# EAGLE design Pure_VCA_SMD_V2_2 (EAGLE 7.5.0)
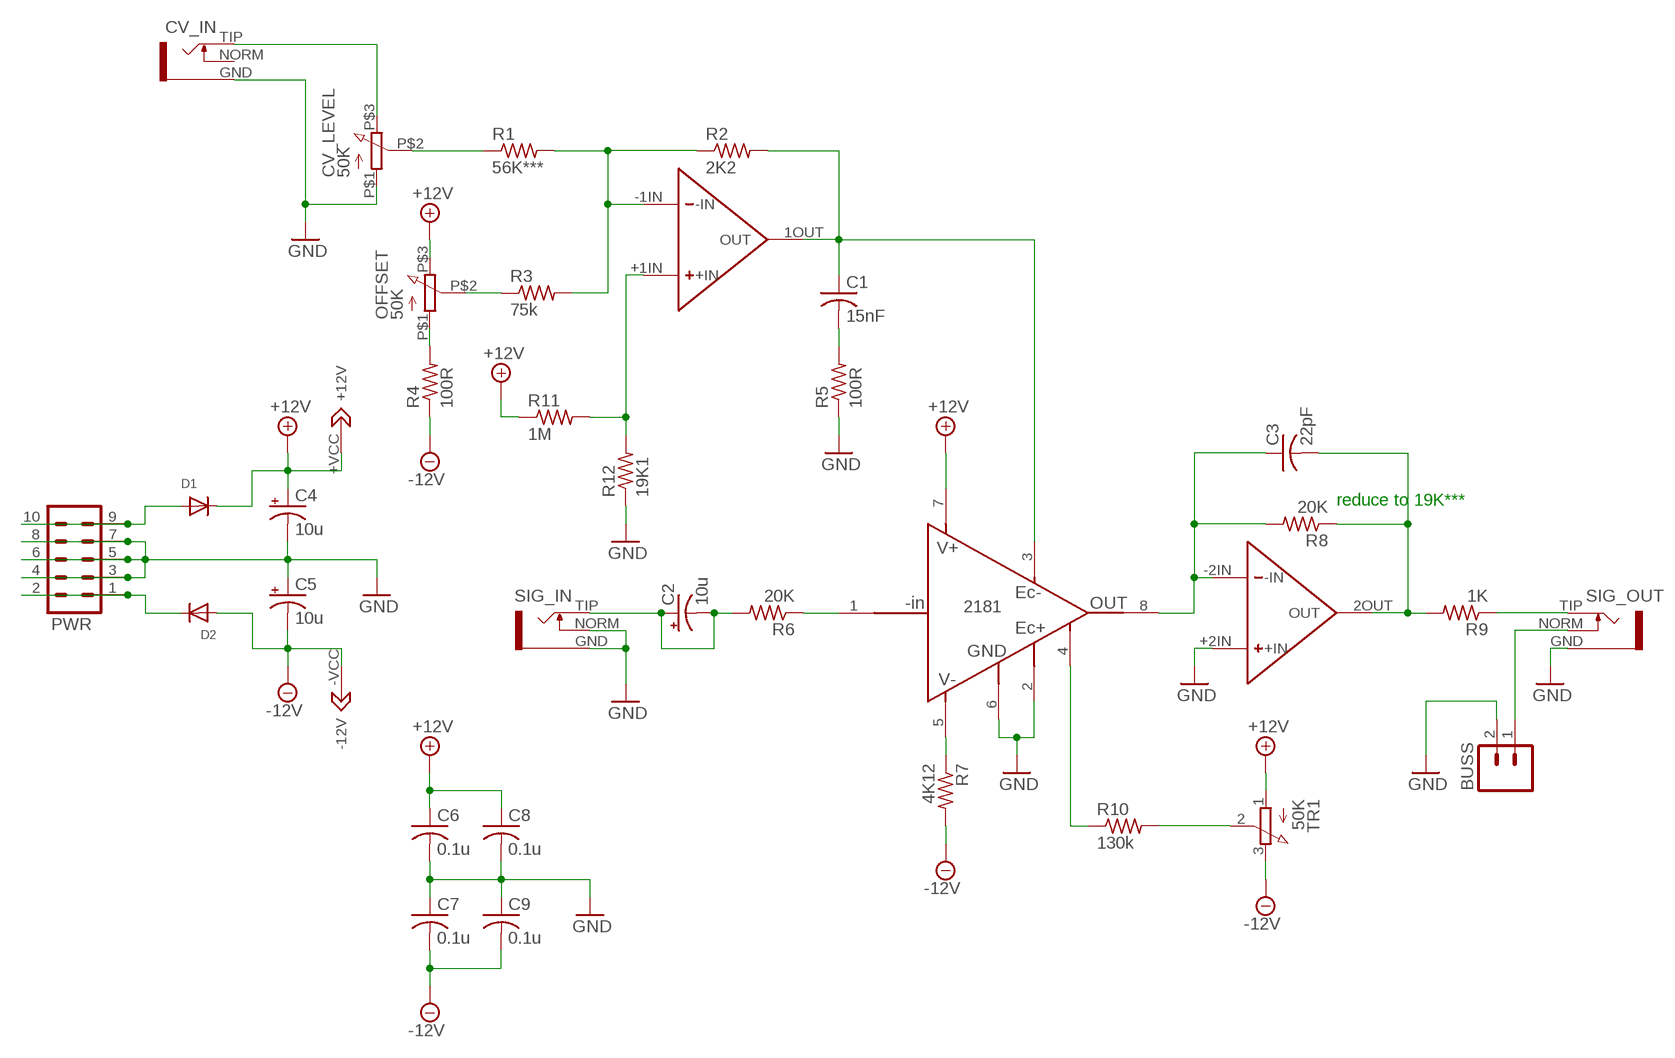
[diagram p0: schematic, sheet 1]

## Parts
BUSS  M02PTH  [1X02]
C1  15nF  C-USC0805K  [C0805K]
C2  10u  CPOL-US153CLV-0505  [153CLV-0505]
C3  22pF  C-USC0805K  [C0805K]
C4  10u  CPOL-US153CLV-0505  [153CLV-0505]
C5  10u  CPOL-US153CLV-0505  [153CLV-0505]
C6  0.1u  C-USC0805K  [C0805K]
C7  0.1u  C-USC0805K  [C0805K]
C8  0.1u  C-USC0805K  [C0805K]
C9  0.1u  C-USC0805K  [C0805K]
CV_IN  S_JACK  [S_JACK]
CV_LEVEL  50K  Q-POT  [Q-POT]
D1  DIODESMA  [SMADIODE]
D2  DIODESMA  [SMADIODE]
OFFSET  50K  Q-POT  [Q-POT]
PWR  M05X2SHD  [2X5-SHROUDED]
R1  56K***  R-US_R0805  [R0805]
R2  2K2  R-US_R0805  [R0805]
R3  75k  R-US_R0805  [R0805]
R4  100R  R-US_R0805  [R0805]
R5  100R  R-US_R0805  [R0805]
R6  20K  R-US_R0805  [R0805]
R7  4K12  R-US_R0805  [R0805]
R8  20K  R-US_R0805  [R0805]
R9  1K  R-US_R0805  [R0805]
R10  130k  R-US_R0805  [R0805]
R11  1M  R-US_R0805  [R0805]
R12  19K1  R-US_R0805  [R0805]
SIG_IN  S_JACK  [S_JACK]
SIG_OUT  S_JACK  [S_JACK]
TR1  50K  TRIM_3269W  [TRIM_3269W]
U1  DUAL_OPAMP  [DUAL_OPAMP]
U2  THAT_2181_SMD  [SOIC--8]

## Nets
+12V: C4.+ C6.1 C8.1 D1.C OFFSET.P$3 R11.1 TR1.1 U1.+VCC(+12V) U2.7(V+)
-12V: C5.- C7.2 C9.2 D2.A R4.1 R7.2 TR1.3 U1.-VCC(-12V)
GND: BUSS.2 C4.- C5.+ C6.2 C7.1 C8.2 C9.1 CV_IN.GND CV_LEVEL.P$1 PWR.3 PWR.4 PWR.5 PWR.6 PWR.7 PWR.8 R5.1 R12.1 SIG_IN.GND SIG_IN.NORM SIG_OUT.GND U1.+2IN(+IN) U2.2(EC+) U2.6(GND)
N$1: CV_IN.TIP CV_LEVEL.P$3
N$2: R1.2 R2.1 R3.2 U1.-1IN(-IN)
N$3: CV_LEVEL.P$2 R1.1
N$4: OFFSET.P$1 R4.2
N$5: C1.1 R2.2 U1.1OUT(OUT) U2.3(EC-)
N$6: OFFSET.P$2 R3.1
N$7: C1.2 R5.2
N$8: R9.1 SIG_OUT.TIP
N$9: R6.1 U2.1(-IN)
N$11: C2.+ C2.- R6.2 SIG_IN.TIP
N$12: BUSS.1 SIG_OUT.NORM
N$13: R7.1 U2.5(V-)
N$14: R11.2 R12.2 U1.+1IN(+IN)
N$15: C3.1 R8.2 U1.-2IN(-IN) U2.8(OUT)
N$16: C3.2 R8.1 R9.2 U1.2OUT(OUT)
N$17: R10.1 U2.4(SYM)
N$18: R10.2 TR1.2
N$38: D1.A PWR.9 PWR.10
N$50: D2.C PWR.1 PWR.2
Unconnected: CV_IN.NORM

## Notes on the sheet
- reduce to 19K***

## Library data of the parts
BUSS = SparkFun-Connectors:M02: Standard 2-pin 0.1" header. Use with - straight break away headers ( PRT-00116) - right angle break away headers (PRT-00553) - swiss pins (PRT-00743) - machine pins (PRT-00117) - female headers (PRT-00115) Molex polarized connector foot print use with: PRT-08233 with associated crimp pins and housings. 2.54_SCREWTERM for use with PRT-10571. 3.5mm Screw Terminal footprints for PRT-08084 5mm Screw Terminal footprints for use with PRT-08433
C1 C3 C6-C9 = rcl:C-US: CAPACITOR, American symbol
C2 C4 C5 = rcl:CPOL-US: POLARIZED CAPACITOR, American symbol
CV_IN SIG_IN SIG_OUT = INSTRUO:S_JACK
CV_LEVEL OFFSET = INSTRUO:Q-POT
D1 D2 = adafruit:DIODE: Diode SMADIODE - SMA Surface Mount Package 20V 1A Schottky Diode Digikey: 641-1014-6-ND DO-1N4148 - Through Hole Small Current Diode SOD-123 20V 1 A (.5mV Vf) Schottky Diode - Digikey: MBRX120TPMSCT-ND SOD-323 10V 570mA (.38mV Vf, 3ns) Schottky Diode - Digikey: ZLLS410CT-ND SOD-523 30V 30mA Schottky Diode (RB751S-40TE61) - Digikey: RB751S-40TE61CT-ND SOT23-R/W - SOT23 Package (R = Solder Paste/Reflow Ovens, W = Hand-Soldering) BAT54Film 40V 300mA - Digikey: 497-7162-1-ND
PWR = SparkFun-Connectors:M05X2: Header 5x2 Standard 10-pin dual row 0.1" header. Commonly used with AVR-ISP. Use with Spark Fun Electronics SKU: PRT-00778
R1-R12 = rcl:R-US_: RESISTOR, American symbol
TR1 = INSTRUO:TRIM_3269W: Manufacturer Part #: 3269W-1-101GLF
U1 = INSTRUO:DUAL_OPAMP
U2 = INSTRUO:THAT_2181_SMD

## Board
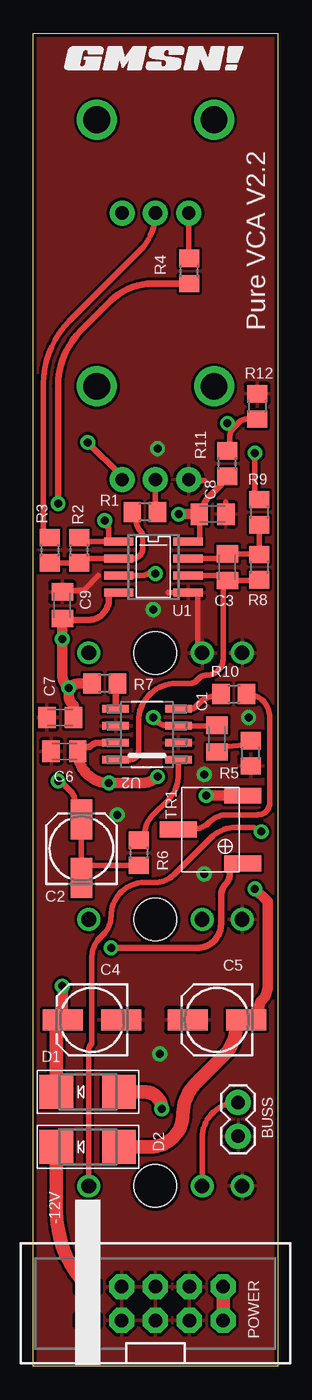
[diagram p1: board, top side]
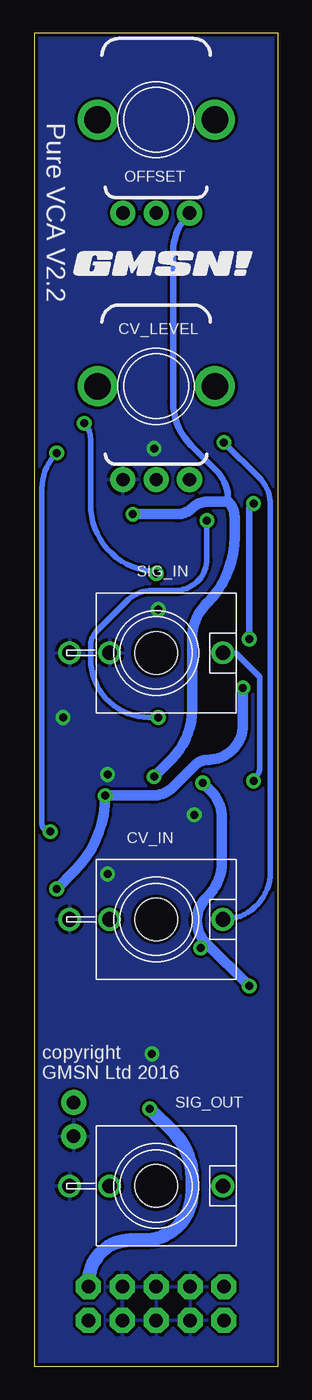
[diagram p2: board, bottom side, seen from below]

Size 18.32 x 100 mm. Coordinates in mm from the lower left corner, seen from the top.
Outline: 18.32,0 0,0 0,100 18.32,100 18.32,0
Copper layers (1*16): Top 0.035mm / dielectric 1.5mm / Bottom 0.035mm
Design rules "SparkFun": minimum track width 8mil, minimum drill 20mil, track to track 8mil, track to pad 8mil, pad to pad 8mil, via to via 8mil, smd to smd 8mil, copper to edge 10mil, drill to drill 8mil, minimum pad ring 12mil, minimum via ring 10mil, stop-mask expansion 4mil, vias tented up to drill 25mil, thermal gap 10mil
Holes 3.2 mm at 9.16,53.52 9.16,13.52 9.16,33.52

### Footprints (pad centres in the part's own frame; a part is rotated, then mirrored left to right if it is on the bottom)
1X02 = drill 1.016 pad 1.88: 1 0,0; 2 2.54,0
C0805K = smd 1.3 x 1.6: 1 -1,0; 2 1,0
153CLV-0505 = smd 3 x 1.6: + 2.2,0; - -2.2,0
S_JACK = drill 1.1: GND 0,-6.5; NORM 0,-3.5; TIP 0,5
Q-POT = drill 1 pad 1.88: P$1 -2.5,-7; P$2 0,-7; P$3 2.5,-7 | drill 2 pad 2.68: P$4 -4.4,0; P$5 4.4,0
SMADIODE = smd 2.54 x 2.54: A 2.349,0; C -2.349,0
2X5-SHROUDED = drill 1.016 pad 1.88 octagon: 1 -1.27,5.08; 2 1.27,5.08; 3 -1.27,2.54; 4 1.27,2.54; 5 -1.27,0; 6 1.27,0; 7 -1.27,-2.54; 8 1.27,-2.54; 9 -1.27,-5.08; 10 1.27,-5.08
R0805 = smd 1.3 x 1.5: 1 -0.95,0; 2 0.95,0
TRIM_3269W = smd 1.19 x 2.79: 1 2.54,2.414; 2 0,-2.414; 3 -2.54,2.414
DUAL_OPAMP = smd 2.2 x 0.6: 1OUT -2.6,1.905; 2OUT 2.6,0.635; +1IN -2.6,-0.635; +2IN 2.6,-1.905; +VCC 2.6,1.905; -1IN -2.6,0.635; -2IN 2.6,-0.635; -VCC -2.6,-1.905
SOIC--8 = smd 1.981 x 0.559: 1 -2.362,1.905; 2 -2.362,0.635; 3 -2.362,-0.635; 4 -2.362,-1.905; 5 2.362,-1.905; 6 2.362,-0.635; 7 2.362,0.635; 8 2.362,1.905

### Placement (x,y rotation side)
BUSS  15.35,19.79 270 top
C1  13.76,47.09 270 top
C2  3.6,38.83 90 top
C3  14.56,59.95 90 top
C4  4.4,25.98 180 top
C5  13.76,25.98 180 top
C6  2.33,46.14 180 top
C7  2.02,48.67 0 top
C8  13.45,63.91 0 top
C9  2.17,57.09 270 top
CV_IN  9.16,33.52 270 bottom
CV_LEVEL  9.16,73.52 0 bottom
D1  4.08,20.58 0 top
D2  4.08,16.46 0 top
OFFSET  9.16,93.52 0 bottom
PWR  9.16,4.7 90 top
R1  8.37,64.07 180 top
R2  3.45,61.22 90 top
R3  1.22,61.22 270 top
R4  11.7,82.17 90 top
R5  16.3,45.98 90 top
R6  7.89,38.52 270 top
R7  5.35,51.21 180 top
R8  16.94,59.95 270 top
R9  16.94,64.07 270 top
R10  15.03,50.42 0 top
R11  14.56,67.72 90 top
R12  16.78,72.01 270 top
SIG_IN  9.16,53.52 270 bottom
SIG_OUT  9.16,13.52 270 bottom
TR1  13.29,40.26 270 top
U1  9,59.95 0 top
U2  8.53,47.41 180 top
U$1  [GMSN!_LOGO]  9.32,98.05 0 top
U$2  [GMSN!_LOGO]  8.37,82.65 0 bottom

### Tracks (layer width: path | path; a pad name or v marks a point on that pad's centre or on a via)
+12V  (via drill 0.6)
  Top 0.4: 12.49,61.85 12.49,63.87
  Top 0.406: U1.+VCC 12.49,61.85 | 12.49,63.87 C8.1
  Top 0.5: U2.7 4.85,46.77 arc45 4.35,46.56 arc-45 4.08,46.45 3.65,46.45 C6.1 | TR1.1 15.38,37.4 14.72,37.4 14.72,36.83 arc-45 14.45,36.18 arc45 14.08,35.3 14.08,33.18 arc-90 12.27,31.37 v5.83,31.37 | C8.1 12.45,64.03 12.81,64.39 12.81,64.47 arc-45 13.09,65.15 13.97,66.02 arc45 14.08,66.3 R11.1
  Top 0.8: C4.+ 2.2,28.49 v2.17,28.51 | C6.1 3.33,46.09 arc90 v5.67,43.75 8.17,43.75 arc45 v9.32,44.23 | v10.91,63.91 C8.1
  Top 1.016: D1.C 1.73,25.51 C4.+
  Bottom 0.5: v5.83,31.37 5.43,31.77 | OFFSET.P$3 arc-45 7.89,83.55 7.89,72.33 arc-45 6.54,69.07 4.67,67.2 arc45 3.76,65.02 3.76,64.87
  Bottom 0.8: v2.17,28.51 5.43,31.77 arc90 5.43,35.1 5.31,35.22 arc-45 4.24,37.81 4.24,41.16 arc-45 5.06,43.15 v5.67,43.75 | v9.32,44.23 8.01,45.54 arc-45 6.46,49.27 6.46,54.62 arc45 5.39,57.21 5.33,57.27 arc-45 3.29,62.2 3.29,63.72 arc-45 3.76,64.87 5.31,64.87 arc-45 6.46,64.39 arc45 7.61,63.91 v10.91,63.91
-12V  (via drill 0.6)
  Top 0.5: U1.-VCC 5.67,58.04 5.67,57.55 arc-90 4.1,55.98 2.29,55.98 C9.2 | R4.1 8.93,81.22 arc45 5.81,79.93 3.56,77.69 arc45 1.86,73.57 v1.86,64.71 | v2.17,54.55 2.02,54.55 2.17,54.39
  Top 0.8: 15.81,26.13 15.97,26.29 16.94,26.29 16.94,26.95 arc-45 17.15,27.45 arc45 17.57,28.48 17.57,34.86 v16.62,35.82 | v12.97,42.8 TR1.3 | v2.65,50.9 arc-45 3.42,51.21 R7.2 | C7.2 3.02,49.46 arc45 2.93,49.67 arc-45 2.65,50.34 v2.65,50.9 | C9.2 2.17,54.39 2.17,51.81 arc45 2.49,51.06 v2.65,50.9
  Top 1.016: D2.A 8.76,16.46 arc90 11.22,18.92 arc-45 12.17,21.21 14.38,23.42 arc45 15.19,25.38 15.19,25.97 15.35,26.13 15.81,26.13 C5.-
  Bottom 0.5: v1.86,64.71 2.17,64.39 v2.17,54.55
  Bottom 0.8: v16.62,35.82 15.33,37.11 arc-45 v12.97,42.8 9.51,42.8 arc-45 7.83,43.5 6.22,45.1 arc45 5.26,45.5 arc-90 2.65,48.11 v2.65,50.9
GND  (via drill 0.6)
  Top 0.4: 4.87,59.31 3.76,58.2 2.6,58.2 | C8.2 14.45,64.82 | 12.81,66.45 11.72,66.45 | 10.11,58.04 U1.+2IN | 12.34,58.04 12.34,53.84 SIG_IN.NORM
  Top 0.406: 2.6,58.2 C9.1 | 11.72,66.45 CV_LEVEL.P$1 | U1.+2IN 12.34,58.04
  other vias: 9.48,23.43 12.81,36.93 6.3,41.37 12.81,44.39 16.14,48.67 9,56.77 9.32,68.84
  pour Top: 18.32,100 0,100 0,0 18.32,0
  pour Bottom: 18.32,100 0,100 0,0 18.32,0
N$1  (via drill 0.6)
  Top 0.4: CV_LEVEL.P$3 arc45 6.51,66.88 v4.08,69.31
  Bottom 0.4: CV_IN.TIP arc-90 0.59,37.09 0.59,64.57 arc-45 1.47,66.7 v4.08,69.31
N$2
  Top 0.4: 3.45,60.58 U1.-1IN 7.41,60.58 arc90 8.21,61.38 8.21,62.21 arc45 8.02,62.68 arc-45 7.73,63.36 7.73,63.91 | R2.1 R3.2
  Top 0.406: 3.45,60.58 R2.1 | R1.2 7.1,64.07 7.73,63.91
N$3
  Top 0.4: CV_LEVEL.P$2 9.16,64.23
  Top 0.406: 9.16,64.23 R1.1
N$4
  Top 0.4: OFFSET.P$1 11.66,83.16 R4.2
N$5  (via drill 0.6)
  Top 0.4: 5.67,61.85 3.45,61.85 | 13.72,48.04 U2.3 10.05,48.04 arc-45 9.34,48.33 v9,48.67 | U1.1OUT 5.67,61.85 | 5.67,61.85 5.67,62.67 arc45 v5.35,63.44
  Top 0.406: 3.45,61.85 R2.2 | 13.72,48.04 C1.1
  Bottom 0.4: v9,48.67 9.69,48.67 arc90 14.08,53.07 14.08,54 arc45 13.58,55.21 11.41,57.38 arc45 9.42,58.2 7.73,58.2 arc-90 5.35,60.58 v5.35,63.44
N$6
  Top 0.4: OFFSET.P$2 arc-45 7.99,83.7 2.7,78.41 arc45 0.75,73.69 0.75,62.56 arc45 0.91,62.17 R3.1
N$7
  Top 0.4: R5.2 15.98,46.93 15.83,46.61 14.08,46.45 14.13,46.45 C1.2
N$8  (via drill 0.6)
  Top 0.4: SIG_OUT.TIP 4.16,23.76 arc-45 4.32,24.15 arc45 4.4,24.33 4.4,30.74 arc-45 4.96,32.09 5.25,32.38 arc45 5.83,33.77 arc-90 8.35,36.29 9.16,36.29 arc45 10.52,36.85 13.29,39.63 arc-45 15.2,40.42 16.33,40.42 arc-45 v17.1,40.1 | v16.62,68.52 16.62,65.34 R9.1
  Bottom 0.4: v17.1,40.1 arc90 17.73,40.74 17.73,65.84 arc45 v16.62,68.52
N$9
  Top 0.4: U2.1 10.89,44.4 arc-45 10.08,42.45 8.93,41.3 arc45 8.37,39.94
  Top 0.406: 8.37,39.94 R6.1
N$11  (via drill 0.6)
  Top 0.4: 3.29,40.1 3.45,40.26 3.45,40.87 C2.+
  Top 0.406: v1.86,43.91 2.02,43.91 2.77,43.16 arc-45 3.13,42.3 3.13,41.51 C2.+ | 3.29,40.1 3.6,39.78 C2.- 3.6,37.09 4.08,37.56 R6.2
  Bottom 0.4: SIG_IN.TIP 3.21,53.52 1.38,51.69 1.38,45.06 arc45 v1.86,43.91
N$12
  Top 0.4: SIG_OUT.NORM 12.66,17.1 arc-90 BUSS.1
  Top 0.406: BUSS.1
N$13
  Top 0.5: U2.5 6.16,51.08 R7.1
N$14  (via drill 0.6)
  Top 0.4: R12.2 16.07,71.06 arc45 15.39,70.78 15.03,70.42 | 15.03,70.42 arc45 14.72,69.66 14.72,68.83 R11.2 | U1.+1IN 7.95,59.31 arc45 8.82,59.6 v9.16,59.47 | v14.56,70.74 14.72,70.74 15.03,70.42
  Bottom 0.4: v9.16,59.47 9.16,59.63 arc90 14.08,64.71 14.08,69.59 arc-45 v14.56,70.74
N$15
  Top 0.4: U1.-2IN 14.19,59.31 | C3.1 16.89,58.95 | U2.8 7.22,45.5 arc90 7.89,46.17 7.89,48.39 arc-90 10.72,51.21 11.72,51.21 arc45 12.22,51.42 12.4,51.6 arc-45 13.01,51.85 arc90 14.24,53.08 14.24,58.63
  Top 0.406: 14.19,59.31 C3.1 14.24,58.63 | 16.89,58.95 R8.2
N$16
  Top 0.4: U1.2OUT 14.19,60.58 | C3.2 16.89,60.95 | R9.2 R8.1
  Top 0.406: 14.19,60.58 C3.2 | 16.89,60.95 R8.1
N$17
  Top 0.4: U2.4 11.83,49.31 arc45 12.15,49.44 12.49,49.78 arc-45 13.65,50.26 13.93,50.26
  Top 0.406: 13.93,50.26 R10.1
N$18
  Top 0.4: R10.2 arc-90 17.73,48.67 17.73,42.27 arc-90 16.83,41.37 14.54,41.37 arc45 13.21,40.82 arc-45 11.86,40.26 TR1.2
N$38  (via drill 0.6)
  Top 1.016: PWR.9 PWR.10 | v9.64,19.31 arc90 8.37,20.58 D1.A
  Bottom 1.016: PWR.10 14.24,6.29 arc90 11.06,9.46 10.06,9.46 arc-90 6.46,13.06 6.46,14.15 arc-45 7.86,17.53 v9.64,19.31
N$50
  Top 1.016: D2.C 1.73,11.64 arc45 PWR.2 PWR.1

### Text on the board
tPlace: Pure VCA V2.2 | TR1 | -12V | POWER
bPlace: Pure VCA V2.2 | OFFSET | CV_LEVEL | copyright / GMSN Ltd 2016